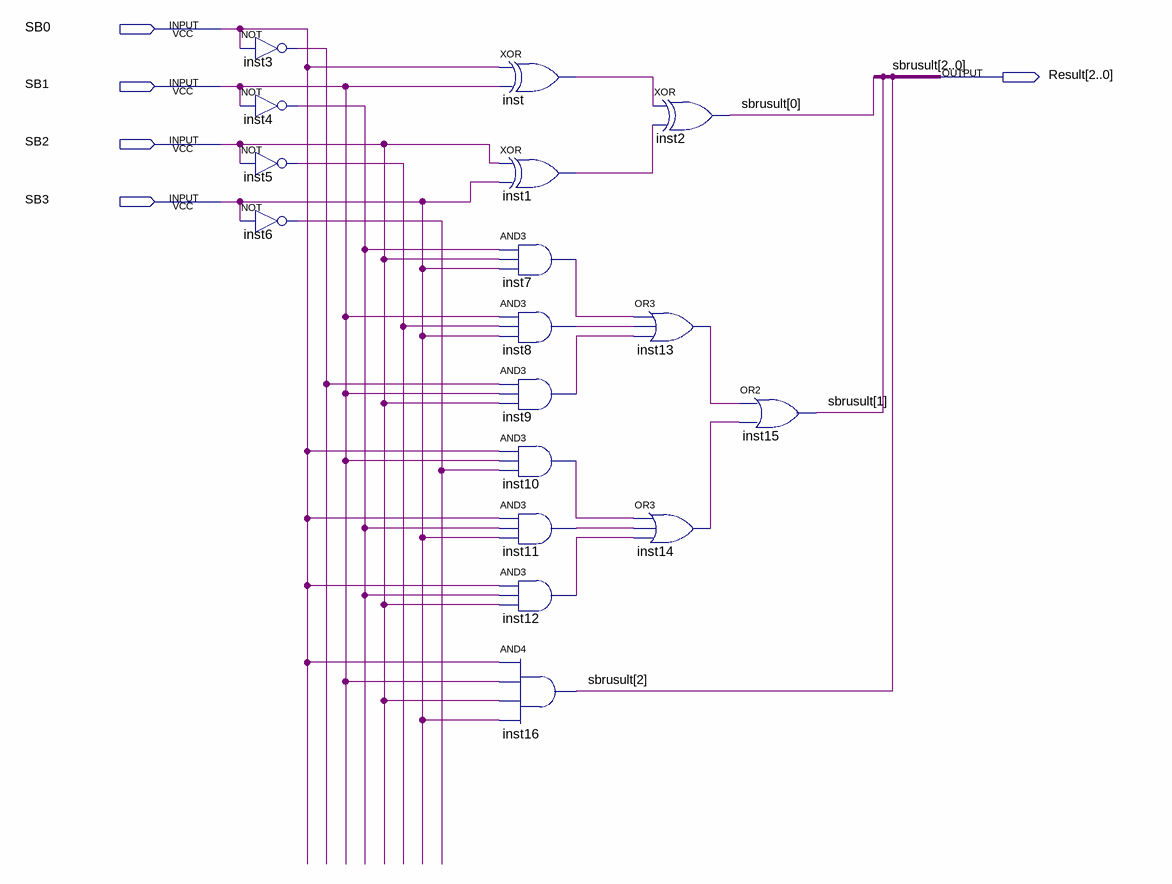
[diagram p0: schematic sheet]
// Quartus schematic sb_calculate.bdf as structural Verilog: 17 symbols, 5 pins
module sb_calculate (
  input  SB0,
  input  SB1,
  input  SB2,
  input  SB3,
  output [2:0] Result
);

  wire inst1_out, inst3_out, inst4_out, inst5_out, inst6_out, inst7_out, inst8_out, inst9_out, inst10_out,
       inst11_out, inst12_out, inst13_out, inst14_out, inst_out;

  not inst3 (inst3_out, SB0);
  not inst4 (inst4_out, SB1);
  not inst5 (inst5_out, SB2);
  not inst6 (inst6_out, SB3);
  xor inst (inst_out, SB0, SB1);
  xor inst1 (inst1_out, SB2, SB3);
  and inst7 (inst7_out, inst4_out, SB2, SB3);
  and inst8 (inst8_out, SB1, inst5_out, SB3);
  and inst9 (inst9_out, inst3_out, SB1, SB2);
  and inst10 (inst10_out, SB0, SB1, inst6_out);
  and inst11 (inst11_out, SB0, inst4_out, SB3);
  and inst12 (inst12_out, SB0, inst4_out, SB2);
  and inst16 (Result[2], SB0, SB1, SB2, SB3);
  xor inst2 (Result[0], inst_out, inst1_out);
  or inst13 (inst13_out, inst7_out, inst8_out, inst9_out);
  or inst14 (inst14_out, inst10_out, inst11_out, inst12_out);
  or inst15 (Result[1], inst13_out, inst14_out);

  // Other names for the same wires on the sheet: sbrusult[2:0] = Result
endmodule
